# Altium schematic sheet FMC.SchDoc: TEBF0808 - FMC
size A4; Organization: Trenz Electronic GmbH; DocumentNumber: TEBF0808; Revision: 04; SheetNumber: 18; SheetTotal: 36; Date: 2016-09-29; CompanyName: Trenz Electronic GmbH; ProjectName: TEB0808 - LAN9514
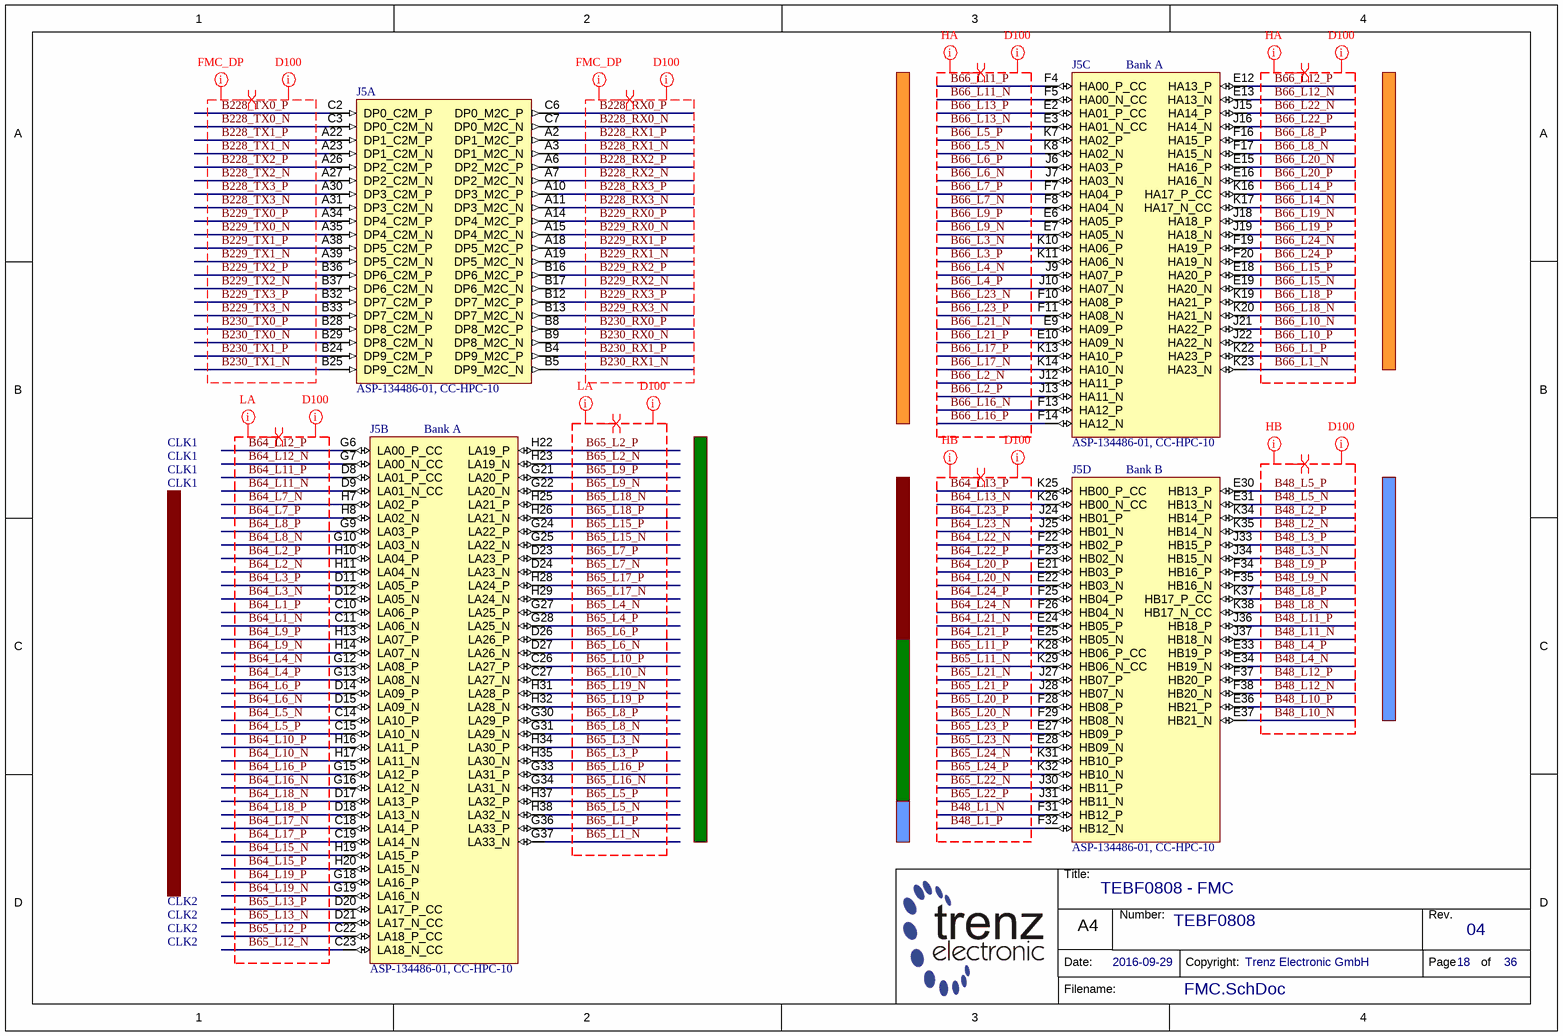
[diagram p0: FMC.SchDoc]

## Parts
J5  ASP-134486-01, CC-HPC-10  [ASP-134486-01B]  (parts A,B,C,D of 9)

## Nets
B48_L1_N: J5.F31(HB12_P)
B48_L1_P: J5.F32(HB12_N)
B48_L2_N: J5.K35(HB14_N)
B48_L2_P: J5.K34(HB14_P)
B48_L3_N: J5.J34(HB15_N)
B48_L3_P: J5.J33(HB15_P)
B48_L4_N: J5.E34(HB19_N)
B48_L4_P: J5.E33(HB19_P)
B48_L5_N: J5.E31(HB13_N)
B48_L5_P: J5.E30(HB13_P)
B48_L8_N: J5.K38(HB17_N_CC)
B48_L8_P: J5.K37(HB17_P_CC)
B48_L9_N: J5.F35(HB16_N)
B48_L9_P: J5.F34(HB16_P)
B48_L10_N: J5.E37(HB21_N)
B48_L10_P: J5.E36(HB21_P)
B48_L11_N: J5.J37(HB18_N)
B48_L11_P: J5.J36(HB18_P)
B48_L12_N: J5.F38(HB20_N)
B48_L12_P: J5.F37(HB20_P)
B64_L1_N: J5.C11(LA06_N)
B64_L1_P: J5.C10(LA06_P)
B64_L2_N: J5.H11(LA04_N)
B64_L2_P: J5.H10(LA04_P)
B64_L3_N: J5.D12(LA05_N)
B64_L3_P: J5.D11(LA05_P)
B64_L4_N: J5.G12(LA08_P)
B64_L4_P: J5.G13(LA08_N)
B64_L5_N: J5.C14(LA10_P)
B64_L5_P: J5.C15(LA10_N)
B64_L6_N: J5.D15(LA09_N)
B64_L6_P: J5.D14(LA09_P)
B64_L7_N: J5.H7(LA02_P)
B64_L7_P: J5.H8(LA02_N)
B64_L8_N: J5.G10(LA03_N)
B64_L8_P: J5.G9(LA03_P)
B64_L9_N: J5.H14(LA07_N)
B64_L9_P: J5.H13(LA07_P)
B64_L10_N: J5.H17(LA11_N)
B64_L10_P: J5.H16(LA11_P)
B64_L11_N: J5.D9(LA01_N_CC)
B64_L11_P: J5.D8(LA01_P_CC)
B64_L12_N: J5.G7(LA00_N_CC)
B64_L12_P: J5.G6(LA00_P_CC)
B64_L13_N: J5.K26(HB00_N_CC)
B64_L13_P: J5.K25(HB00_P_CC)
B64_L15_N: J5.H19(LA15_P)
B64_L15_P: J5.H20(LA15_N)
B64_L16_N: J5.G16(LA12_N)
B64_L16_P: J5.G15(LA12_P)
B64_L17_N: J5.C18(LA14_P)
B64_L17_P: J5.C19(LA14_N)
B64_L18_N: J5.D17(LA13_P)
B64_L18_P: J5.D18(LA13_N)
B64_L19_N: J5.G19(LA16_N)
B64_L19_P: J5.G18(LA16_P)
B64_L20_N: J5.E22(HB03_N)
B64_L20_P: J5.E21(HB03_P)
B64_L21_N: J5.E24(HB05_P)
B64_L21_P: J5.E25(HB05_N)
B64_L22_N: J5.F22(HB02_P)
B64_L22_P: J5.F23(HB02_N)
B64_L23_N: J5.J25(HB01_N)
B64_L23_P: J5.J24(HB01_P)
B64_L24_N: J5.F26(HB04_N)
B64_L24_P: J5.F25(HB04_P)
B65_L1_N: J5.G37(LA33_N)
B65_L1_P: J5.G36(LA33_P)
B65_L2_N: J5.H23(LA19_N)
B65_L2_P: J5.H22(LA19_P)
B65_L3_N: J5.H34(LA30_P)
B65_L3_P: J5.H35(LA30_N)
B65_L4_N: J5.G27(LA25_P)
B65_L4_P: J5.G28(LA25_N)
B65_L5_N: J5.H38(LA32_N)
B65_L5_P: J5.H37(LA32_P)
B65_L6_N: J5.D27(LA26_N)
B65_L6_P: J5.D26(LA26_P)
B65_L7_N: J5.D24(LA23_N)
B65_L7_P: J5.D23(LA23_P)
B65_L8_N: J5.G31(LA29_N)
B65_L8_P: J5.G30(LA29_P)
B65_L9_N: J5.G22(LA20_N)
B65_L9_P: J5.G21(LA20_P)
B65_L10_N: J5.C27(LA27_N)
B65_L10_P: J5.C26(LA27_P)
B65_L11_N: J5.K29(HB06_N_CC)
B65_L11_P: J5.K28(HB06_P_CC)
B65_L12_N: J5.C23(LA18_N_CC)
B65_L12_P: J5.C22(LA18_P_CC)
B65_L13_N: J5.D21(LA17_N_CC)
B65_L13_P: J5.D20(LA17_P_CC)
B65_L15_N: J5.G25(LA22_N)
B65_L15_P: J5.G24(LA22_P)
B65_L16_N: J5.G34(LA31_N)
B65_L16_P: J5.G33(LA31_P)
B65_L17_N: J5.H29(LA24_N)
B65_L17_P: J5.H28(LA24_P)
B65_L18_N: J5.H25(LA21_P)
B65_L18_P: J5.H26(LA21_N)
B65_L19_N: J5.H31(LA28_P)
B65_L19_P: J5.H32(LA28_N)
B65_L20_N: J5.F29(HB08_N)
B65_L20_P: J5.F28(HB08_P)
B65_L21_N: J5.J27(HB07_P)
B65_L21_P: J5.J28(HB07_N)
B65_L22_N: J5.J30(HB11_P)
B65_L22_P: J5.J31(HB11_N)
B65_L23_N: J5.E28(HB09_N)
B65_L23_P: J5.E27(HB09_P)
B65_L24_N: J5.K31(HB10_P)
B65_L24_P: J5.K32(HB10_N)
B66_L1_N: J5.K23(HA23_N)
B66_L1_P: J5.K22(HA23_P)
B66_L2_N: J5.J12(HA11_P)
B66_L2_P: J5.J13(HA11_N)
B66_L3_N: J5.K10(HA06_P)
B66_L3_P: J5.K11(HA06_N)
B66_L4_N: J5.J9(HA07_P)
B66_L4_P: J5.J10(HA07_N)
B66_L5_N: J5.K8(HA02_N)
B66_L5_P: J5.K7(HA02_P)
B66_L6_N: J5.J7(HA03_N)
B66_L6_P: J5.J6(HA03_P)
B66_L7_N: J5.F8(HA04_N)
B66_L7_P: J5.F7(HA04_P)
B66_L8_N: J5.F17(HA15_N)
B66_L8_P: J5.F16(HA15_P)
B66_L9_N: J5.E7(HA05_N)
B66_L9_P: J5.E6(HA05_P)
B66_L10_N: J5.J21(HA22_P)
B66_L10_P: J5.J22(HA22_N)
B66_L11_N: J5.F5(HA00_N_CC)
B66_L11_P: J5.F4(HA00_P_CC)
B66_L12_N: J5.E13(HA13_N)
B66_L12_P: J5.E12(HA13_P)
B66_L13_N: J5.E3(HA01_N_CC)
B66_L13_P: J5.E2(HA01_P_CC)
B66_L14_N: J5.K17(HA17_N_CC)
B66_L14_P: J5.K16(HA17_P_CC)
B66_L15_N: J5.E19(HA20_N)
B66_L15_P: J5.E18(HA20_P)
B66_L16_N: J5.F13(HA12_P)
B66_L16_P: J5.F14(HA12_N)
B66_L17_N: J5.K14(HA10_N)
B66_L17_P: J5.K13(HA10_P)
B66_L18_N: J5.K20(HA21_N)
B66_L18_P: J5.K19(HA21_P)
B66_L19_N: J5.J18(HA18_P)
B66_L19_P: J5.J19(HA18_N)
B66_L20_N: J5.E15(HA16_P)
B66_L20_P: J5.E16(HA16_N)
B66_L21_N: J5.E9(HA09_P)
B66_L21_P: J5.E10(HA09_N)
B66_L22_N: J5.J15(HA14_P)
B66_L22_P: J5.J16(HA14_N)
B66_L23_N: J5.F10(HA08_P)
B66_L23_P: J5.F11(HA08_N)
B66_L24_N: J5.F19(HA19_P)
B66_L24_P: J5.F20(HA19_N)
B228_RX0_N: J5.C7(DP0_M2C_N)
B228_RX0_P: J5.C6(DP0_M2C_P)
B228_RX1_N: J5.A3(DP1_M2C_N)
B228_RX1_P: J5.A2(DP1_M2C_P)
B228_RX2_N: J5.A7(DP2_M2C_N)
B228_RX2_P: J5.A6(DP2_M2C_P)
B228_RX3_N: J5.A11(DP3_M2C_N)
B228_RX3_P: J5.A10(DP3_M2C_P)
B228_TX0_N: J5.C3(DP0_C2M_N)
B228_TX0_P: J5.C2(DP0_C2M_P)
B228_TX1_N: J5.A23(DP1_C2M_N)
B228_TX1_P: J5.A22(DP1_C2M_P)
B228_TX2_N: J5.A27(DP2_C2M_N)
B228_TX2_P: J5.A26(DP2_C2M_P)
B228_TX3_N: J5.A31(DP3_C2M_N)
B228_TX3_P: J5.A30(DP3_C2M_P)
B229_RX0_N: J5.A15(DP4_M2C_N)
B229_RX0_P: J5.A14(DP4_M2C_P)
B229_RX1_N: J5.A19(DP5_M2C_N)
B229_RX1_P: J5.A18(DP5_M2C_P)
B229_RX2_N: J5.B17(DP6_M2C_N)
B229_RX2_P: J5.B16(DP6_M2C_P)
B229_RX3_N: J5.B13(DP7_M2C_N)
B229_RX3_P: J5.B12(DP7_M2C_P)
B229_TX0_N: J5.A35(DP4_C2M_N)
B229_TX0_P: J5.A34(DP4_C2M_P)
B229_TX1_N: J5.A39(DP5_C2M_N)
B229_TX1_P: J5.A38(DP5_C2M_P)
B229_TX2_N: J5.B37(DP6_C2M_N)
B229_TX2_P: J5.B36(DP6_C2M_P)
B229_TX3_N: J5.B33(DP7_C2M_N)
B229_TX3_P: J5.B32(DP7_C2M_P)
B230_RX0_N: J5.B9(DP8_M2C_N)
B230_RX0_P: J5.B8(DP8_M2C_P)
B230_RX1_N: J5.B5(DP9_M2C_N)
B230_RX1_P: J5.B4(DP9_M2C_P)
B230_TX0_N: J5.B29(DP8_C2M_N)
B230_TX0_P: J5.B28(DP8_C2M_P)
B230_TX1_N: J5.B25(DP9_C2M_N)
B230_TX1_P: J5.B24(DP9_C2M_P)

## Layout directives
differential pair: B48_L1_N, B48_L1_P, B48_L2_N, B48_L2_P, B48_L3_N, B48_L3_P, B48_L4_N, B48_L4_P, B48_L5_N, B48_L5_P, B48_L8_N, B48_L8_P, B48_L9_N, B48_L9_P, B48_L10_N, B48_L10_P, B48_L11_N, B48_L11_P, B48_L12_N, B48_L12_P, B64_L1_N, B64_L1_P, B64_L2_N, B64_L2_P, B64_L3_N, B64_L3_P, B64_L4_N, B64_L4_P, B64_L5_N, B64_L5_P, B64_L6_N, B64_L6_P, B64_L7_N, B64_L7_P, B64_L8_N, B64_L8_P, B64_L9_N, B64_L9_P, B64_L10_N, B64_L10_P, B64_L11_N, B64_L11_P, B64_L12_N, B64_L12_P, B64_L13_N, B64_L13_P, B64_L15_N, B64_L15_P, B64_L16_N, B64_L16_P, B64_L17_N, B64_L17_P, B64_L18_N, B64_L18_P, B64_L19_N, B64_L19_P, B64_L20_N, B64_L20_P, B64_L21_N, B64_L21_P, B64_L22_N, B64_L22_P, B64_L23_N, B64_L23_P, B64_L24_N, B64_L24_P, B65_L1_N, B65_L1_P, B65_L2_N, B65_L2_P, B65_L3_N, B65_L3_P, B65_L4_N, B65_L4_P, B65_L5_N, B65_L5_P, B65_L6_N, B65_L6_P, B65_L7_N, B65_L7_P, B65_L8_N, B65_L8_P, B65_L9_N, B65_L9_P, B65_L10_N, B65_L10_P, B65_L11_N, B65_L11_P, B65_L12_N, B65_L12_P, B65_L13_N, B65_L13_P, B65_L15_N, B65_L15_P, B65_L16_N, B65_L16_P, B65_L17_N, B65_L17_P, B65_L18_N, B65_L18_P, B65_L19_N, B65_L19_P, B65_L20_N, B65_L20_P, B65_L21_N, B65_L21_P, B65_L22_N, B65_L22_P, B65_L23_N, B65_L23_P, B65_L24_N, B65_L24_P, B66_L1_N, B66_L1_P, B66_L2_N, B66_L2_P, B66_L3_N, B66_L3_P, B66_L4_N, B66_L4_P, B66_L5_N, B66_L5_P, B66_L6_N, B66_L6_P, B66_L7_N, B66_L7_P, B66_L8_N, B66_L8_P, B66_L9_N, B66_L9_P, B66_L10_N, B66_L10_P, B66_L11_N, B66_L11_P, B66_L12_N, B66_L12_P, B66_L13_N, B66_L13_P, B66_L14_N, B66_L14_P, B66_L15_N, B66_L15_P, B66_L16_N, B66_L16_P, B66_L17_N, B66_L17_P, B66_L18_N, B66_L18_P, B66_L19_N, B66_L19_P, B66_L20_N, B66_L20_P, B66_L21_N, B66_L21_P, B66_L22_N, B66_L22_P, B66_L23_N, B66_L23_P, B66_L24_N, B66_L24_P, B228_RX0_N, B228_RX0_P, B228_RX1_N, B228_RX1_P, B228_RX2_N, B228_RX2_P, B228_RX3_N, B228_RX3_P, B228_TX0_N, B228_TX0_P, B228_TX1_N, B228_TX1_P, B228_TX2_N, B228_TX2_P, B228_TX3_N, B228_TX3_P, B229_RX0_N, B229_RX0_P, B229_RX1_N, B229_RX1_P, B229_RX2_N, B229_RX2_P, B229_RX3_N, B229_RX3_P, B229_TX0_N, B229_TX0_P, B229_TX1_N, B229_TX1_P, B229_TX2_N, B229_TX2_P, B229_TX3_N, B229_TX3_P, B230_RX0_N, B230_RX0_P, B230_RX1_N, B230_RX1_P, B230_TX0_N, B230_TX0_P, B230_TX1_N, B230_TX1_P
net class FMC_DP: B228_RX0_N, B228_RX0_P, B228_RX1_N, B228_RX1_P, B228_RX2_N, B228_RX2_P, B228_RX3_N, B228_RX3_P, B228_TX0_N, B228_TX0_P, B228_TX1_N, B228_TX1_P, B228_TX2_N, B228_TX2_P, B228_TX3_N, B228_TX3_P, B229_RX0_N, B229_RX0_P, B229_RX1_N, B229_RX1_P, B229_RX2_N, B229_RX2_P, B229_RX3_N, B229_RX3_P, B229_TX0_N, B229_TX0_P, B229_TX1_N, B229_TX1_P, B229_TX2_N, B229_TX2_P, B229_TX3_N, B229_TX3_P, B230_RX0_N, B230_RX0_P, B230_RX1_N, B230_RX1_P, B230_TX0_N, B230_TX0_P, B230_TX1_N, B230_TX1_P
net class LA: B64_L1_N, B64_L1_P, B64_L2_N, B64_L2_P, B64_L3_N, B64_L3_P, B64_L4_N, B64_L4_P, B64_L5_N, B64_L5_P, B64_L6_N, B64_L6_P, B64_L7_N, B64_L7_P, B64_L8_N, B64_L8_P, B64_L9_N, B64_L9_P, B64_L10_N, B64_L10_P, B64_L11_N, B64_L11_P, B64_L12_N, B64_L12_P, B64_L15_N, B64_L15_P, B64_L16_N, B64_L16_P, B64_L17_N, B64_L17_P, B64_L18_N, B64_L18_P, B64_L19_N, B64_L19_P, B65_L1_N, B65_L1_P, B65_L2_N, B65_L2_P, B65_L3_N, B65_L3_P, B65_L4_N, B65_L4_P, B65_L5_N, B65_L5_P, B65_L6_N, B65_L6_P, B65_L7_N, B65_L7_P, B65_L8_N, B65_L8_P, B65_L9_N, B65_L9_P, B65_L10_N, B65_L10_P, B65_L12_N, B65_L12_P, B65_L13_N, B65_L13_P, B65_L15_N, B65_L15_P, B65_L16_N, B65_L16_P, B65_L17_N, B65_L17_P, B65_L18_N, B65_L18_P, B65_L19_N, B65_L19_P
net class D100: B48_L1_N, B48_L1_P, B48_L2_N, B48_L2_P, B48_L3_N, B48_L3_P, B48_L4_N, B48_L4_P, B48_L5_N, B48_L5_P, B48_L8_N, B48_L8_P, B48_L9_N, B48_L9_P, B48_L10_N, B48_L10_P, B48_L11_N, B48_L11_P, B48_L12_N, B48_L12_P, B64_L1_N, B64_L1_P, B64_L2_N, B64_L2_P, B64_L3_N, B64_L3_P, B64_L4_N, B64_L4_P, B64_L5_N, B64_L5_P, B64_L6_N, B64_L6_P, B64_L7_N, B64_L7_P, B64_L8_N, B64_L8_P, B64_L9_N, B64_L9_P, B64_L10_N, B64_L10_P, B64_L11_N, B64_L11_P, B64_L12_N, B64_L12_P, B64_L13_N, B64_L13_P, B64_L15_N, B64_L15_P, B64_L16_N, B64_L16_P, B64_L17_N, B64_L17_P, B64_L18_N, B64_L18_P, B64_L19_N, B64_L19_P, B64_L20_N, B64_L20_P, B64_L21_N, B64_L21_P, B64_L22_N, B64_L22_P, B64_L23_N, B64_L23_P, B64_L24_N, B64_L24_P, B65_L1_N, B65_L1_P, B65_L2_N, B65_L2_P, B65_L3_N, B65_L3_P, B65_L4_N, B65_L4_P, B65_L5_N, B65_L5_P, B65_L6_N, B65_L6_P, B65_L7_N, B65_L7_P, B65_L8_N, B65_L8_P, B65_L9_N, B65_L9_P, B65_L10_N, B65_L10_P, B65_L11_N, B65_L11_P, B65_L12_N, B65_L12_P, B65_L13_N, B65_L13_P, B65_L15_N, B65_L15_P, B65_L16_N, B65_L16_P, B65_L17_N, B65_L17_P, B65_L18_N, B65_L18_P, B65_L19_N, B65_L19_P, B65_L20_N, B65_L20_P, B65_L21_N, B65_L21_P, B65_L22_N, B65_L22_P, B65_L23_N, B65_L23_P, B65_L24_N, B65_L24_P, B66_L1_N, B66_L1_P, B66_L2_N, B66_L2_P, B66_L3_N, B66_L3_P, B66_L4_N, B66_L4_P, B66_L5_N, B66_L5_P, B66_L6_N, B66_L6_P, B66_L7_N, B66_L7_P, B66_L8_N, B66_L8_P, B66_L9_N, B66_L9_P, B66_L10_N, B66_L10_P, B66_L11_N, B66_L11_P, B66_L12_N, B66_L12_P, B66_L13_N, B66_L13_P, B66_L14_N, B66_L14_P, B66_L15_N, B66_L15_P, B66_L16_N, B66_L16_P, B66_L17_N, B66_L17_P, B66_L18_N, B66_L18_P, B66_L19_N, B66_L19_P, B66_L20_N, B66_L20_P, B66_L21_N, B66_L21_P, B66_L22_N, B66_L22_P, B66_L23_N, B66_L23_P, B66_L24_N, B66_L24_P, B228_RX0_N, B228_RX0_P, B228_RX1_N, B228_RX1_P, B228_RX2_N, B228_RX2_P, B228_RX3_N, B228_RX3_P, B228_TX0_N, B228_TX0_P, B228_TX1_N, B228_TX1_P, B228_TX2_N, B228_TX2_P, B228_TX3_N, B228_TX3_P, B229_RX0_N, B229_RX0_P, B229_RX1_N, B229_RX1_P, B229_RX2_N, B229_RX2_P, B229_RX3_N, B229_RX3_P, B229_TX0_N, B229_TX0_P, B229_TX1_N, B229_TX1_P, B229_TX2_N, B229_TX2_P, B229_TX3_N, B229_TX3_P, B230_RX0_N, B230_RX0_P, B230_RX1_N, B230_RX1_P, B230_TX0_N, B230_TX0_P, B230_TX1_N, B230_TX1_P
net class HA: B66_L1_N, B66_L1_P, B66_L2_N, B66_L2_P, B66_L3_N, B66_L3_P, B66_L4_N, B66_L4_P, B66_L5_N, B66_L5_P, B66_L6_N, B66_L6_P, B66_L7_N, B66_L7_P, B66_L8_N, B66_L8_P, B66_L9_N, B66_L9_P, B66_L10_N, B66_L10_P, B66_L11_N, B66_L11_P, B66_L12_N, B66_L12_P, B66_L13_N, B66_L13_P, B66_L14_N, B66_L14_P, B66_L15_N, B66_L15_P, B66_L16_N, B66_L16_P, B66_L17_N, B66_L17_P, B66_L18_N, B66_L18_P, B66_L19_N, B66_L19_P, B66_L20_N, B66_L20_P, B66_L21_N, B66_L21_P, B66_L22_N, B66_L22_P, B66_L23_N, B66_L23_P, B66_L24_N, B66_L24_P
net class HB: B48_L1_N, B48_L1_P, B48_L2_N, B48_L2_P, B48_L3_N, B48_L3_P, B48_L4_N, B48_L4_P, B48_L5_N, B48_L5_P, B48_L8_N, B48_L8_P, B48_L9_N, B48_L9_P, B48_L10_N, B48_L10_P, B48_L11_N, B48_L11_P, B48_L12_N, B48_L12_P, B64_L13_N, B64_L13_P, B64_L20_N, B64_L20_P, B64_L21_N, B64_L21_P, B64_L22_N, B64_L22_P, B64_L23_N, B64_L23_P, B64_L24_N, B64_L24_P, B65_L11_N, B65_L11_P, B65_L20_N, B65_L20_P, B65_L21_N, B65_L21_P, B65_L22_N, B65_L22_P, B65_L23_N, B65_L23_P, B65_L24_N, B65_L24_P

## Notes on the sheet
- (near J5) Bank A
- CLK1
- (near J5) Bank B
- CLK2
- Title:
- Number:
- Rev.
- Date:
- A4
- Copyright:
- Page
- of
- Filename:

## Library data of the parts
J5 = 24851: ASP-134486-01 female, CC-HPC-10; AN: 24851; Mixed: SMT; Trenz-Stock: Yes; HelpURL: B:\AD\adlib\datasheet\Samtec; H-ART: ASP-134486-01